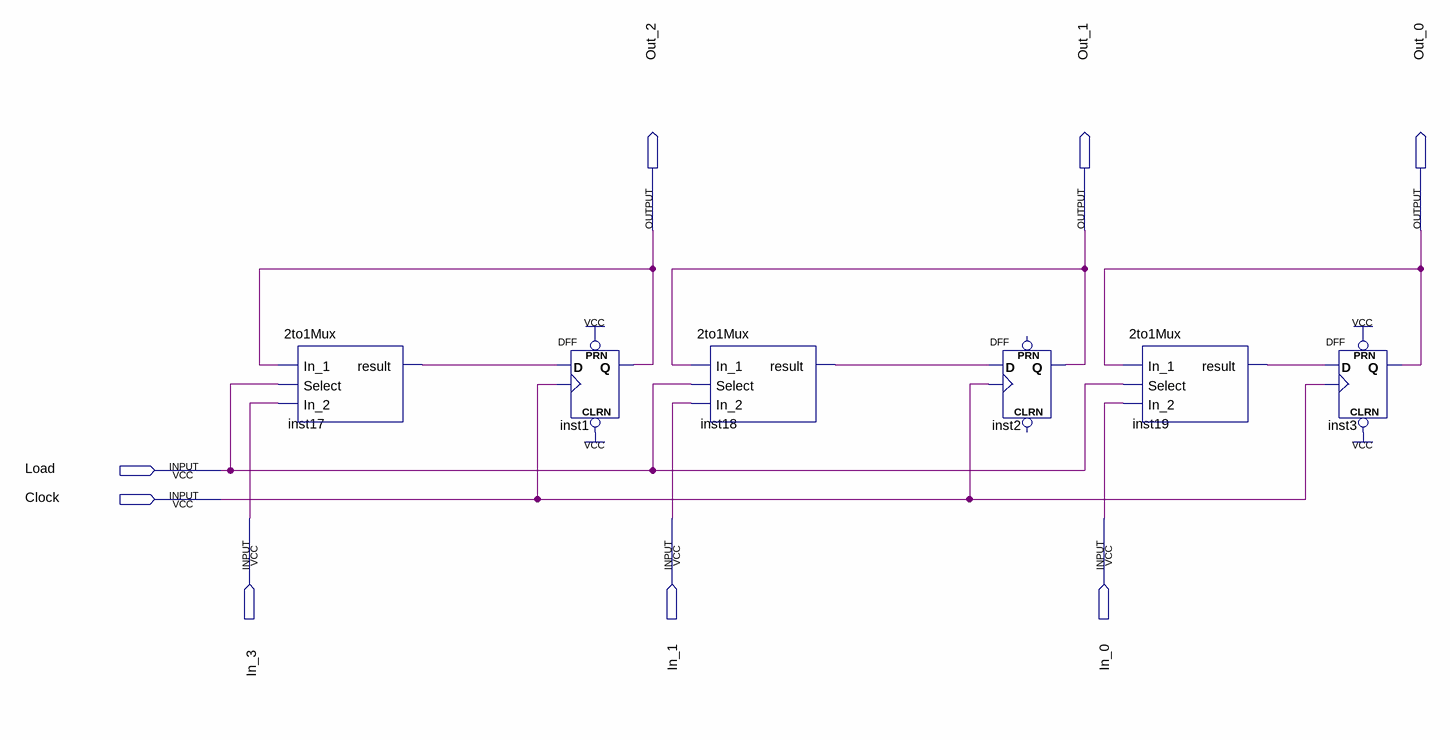
[diagram p0: schematic sheet]
// Quartus schematic 3bitRegister.bdf as structural Verilog: 6 symbols, 8 pins
module \3bitRegister  (
  input  Load,
  input  Clock,
  input  In_3,
  input  In_1,
  input  In_0,
  output Out_2,
  output Out_1,
  output Out_0
);

  wire inst17_result, inst18_result, inst19_result;

  \2to1Mux  inst17 (.In_1(Out_2), .Select(Load), .In_2(In_3), .result(inst17_result));
  DFF inst1 (.CLRN(1'b1), .CLK(Clock), .D(inst17_result), .PRN(1'b1), .Q(Out_2));
  \2to1Mux  inst18 (.In_1(Out_1), .Select(Load), .In_2(In_1), .result(inst18_result));
  DFF inst2 (.CLK(Clock), .D(inst18_result), .Q(Out_1));  // open: CLRN, PRN
  \2to1Mux  inst19 (.In_1(Out_0), .Select(Load), .In_2(In_0), .result(inst19_result));
  DFF inst3 (.CLRN(1'b1), .CLK(Clock), .D(inst19_result), .PRN(1'b1), .Q(Out_0));
endmodule
